# Altium schematic sheet 0271_GDDR6 VDD POL VREG.SchDoc
size 848 x 558 mm
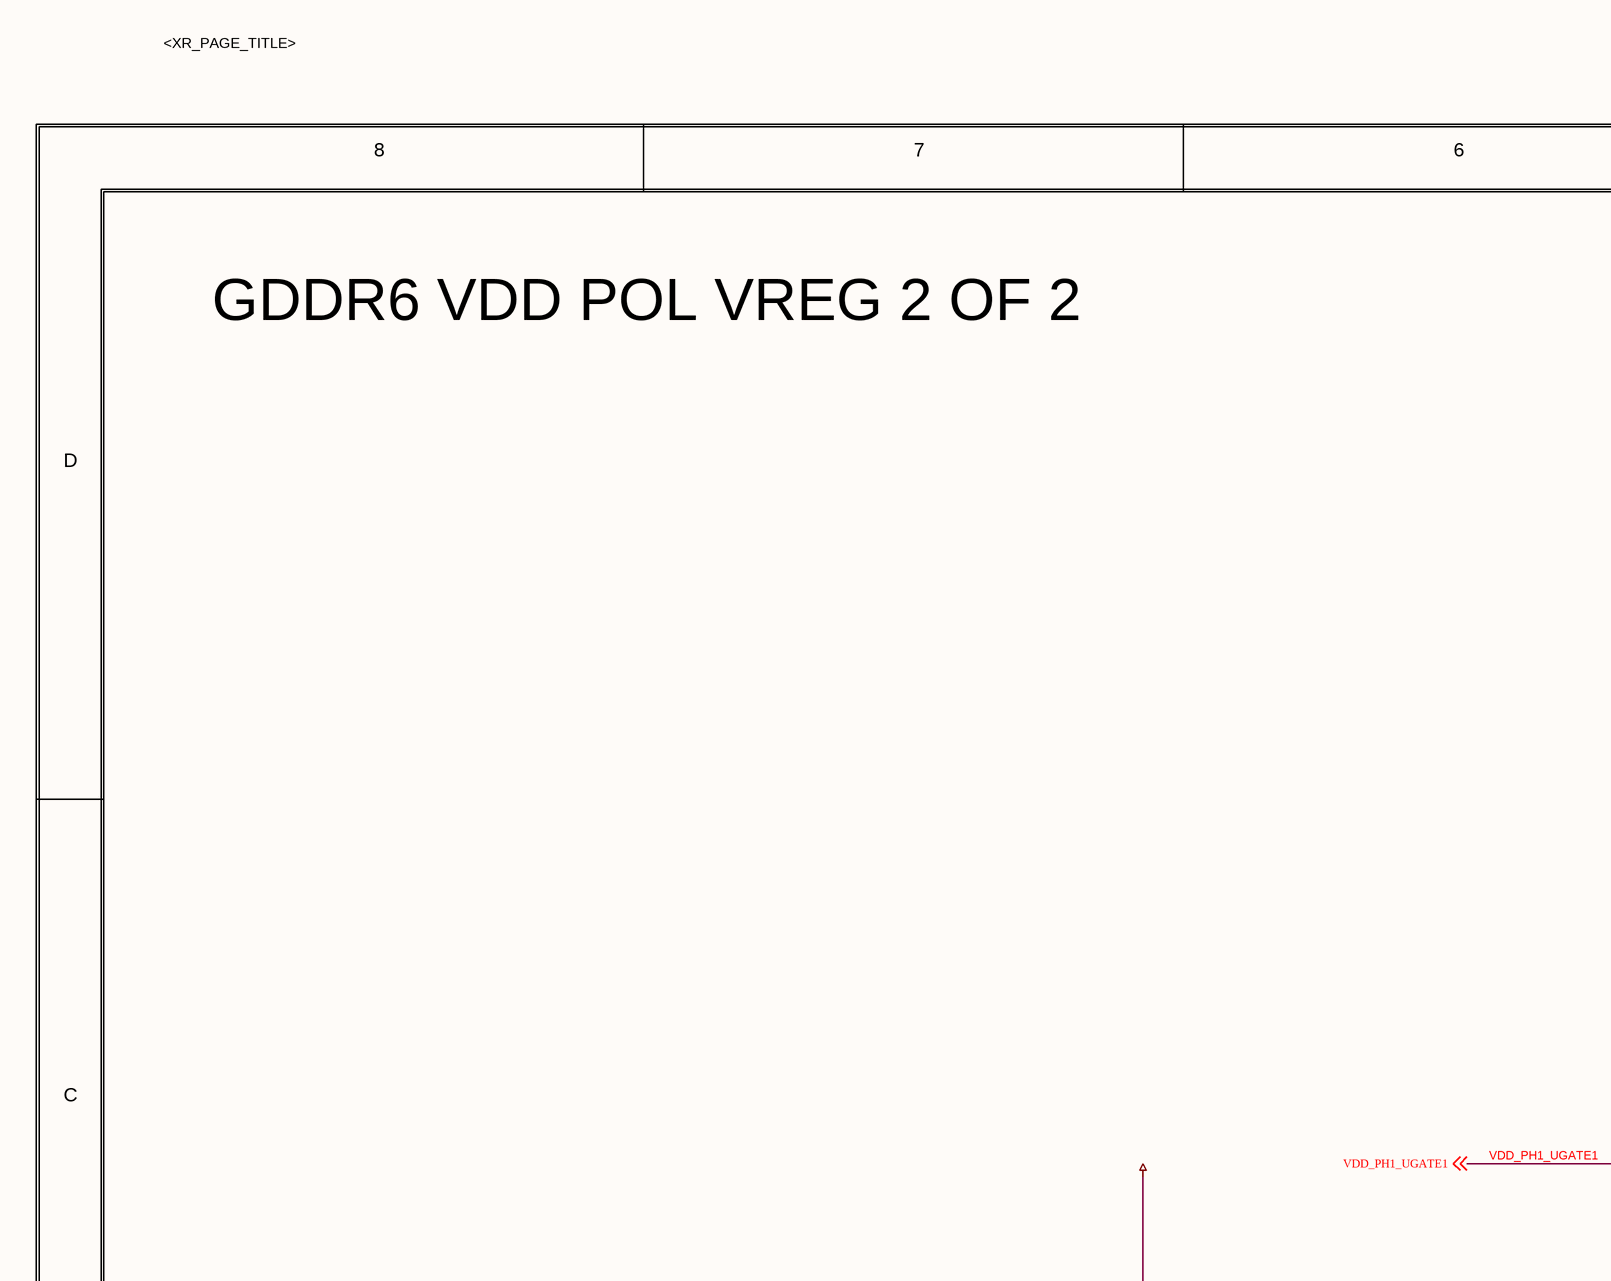
[diagram p0: 0271_GDDR6 VDD POL VREG.SchDoc, top left]
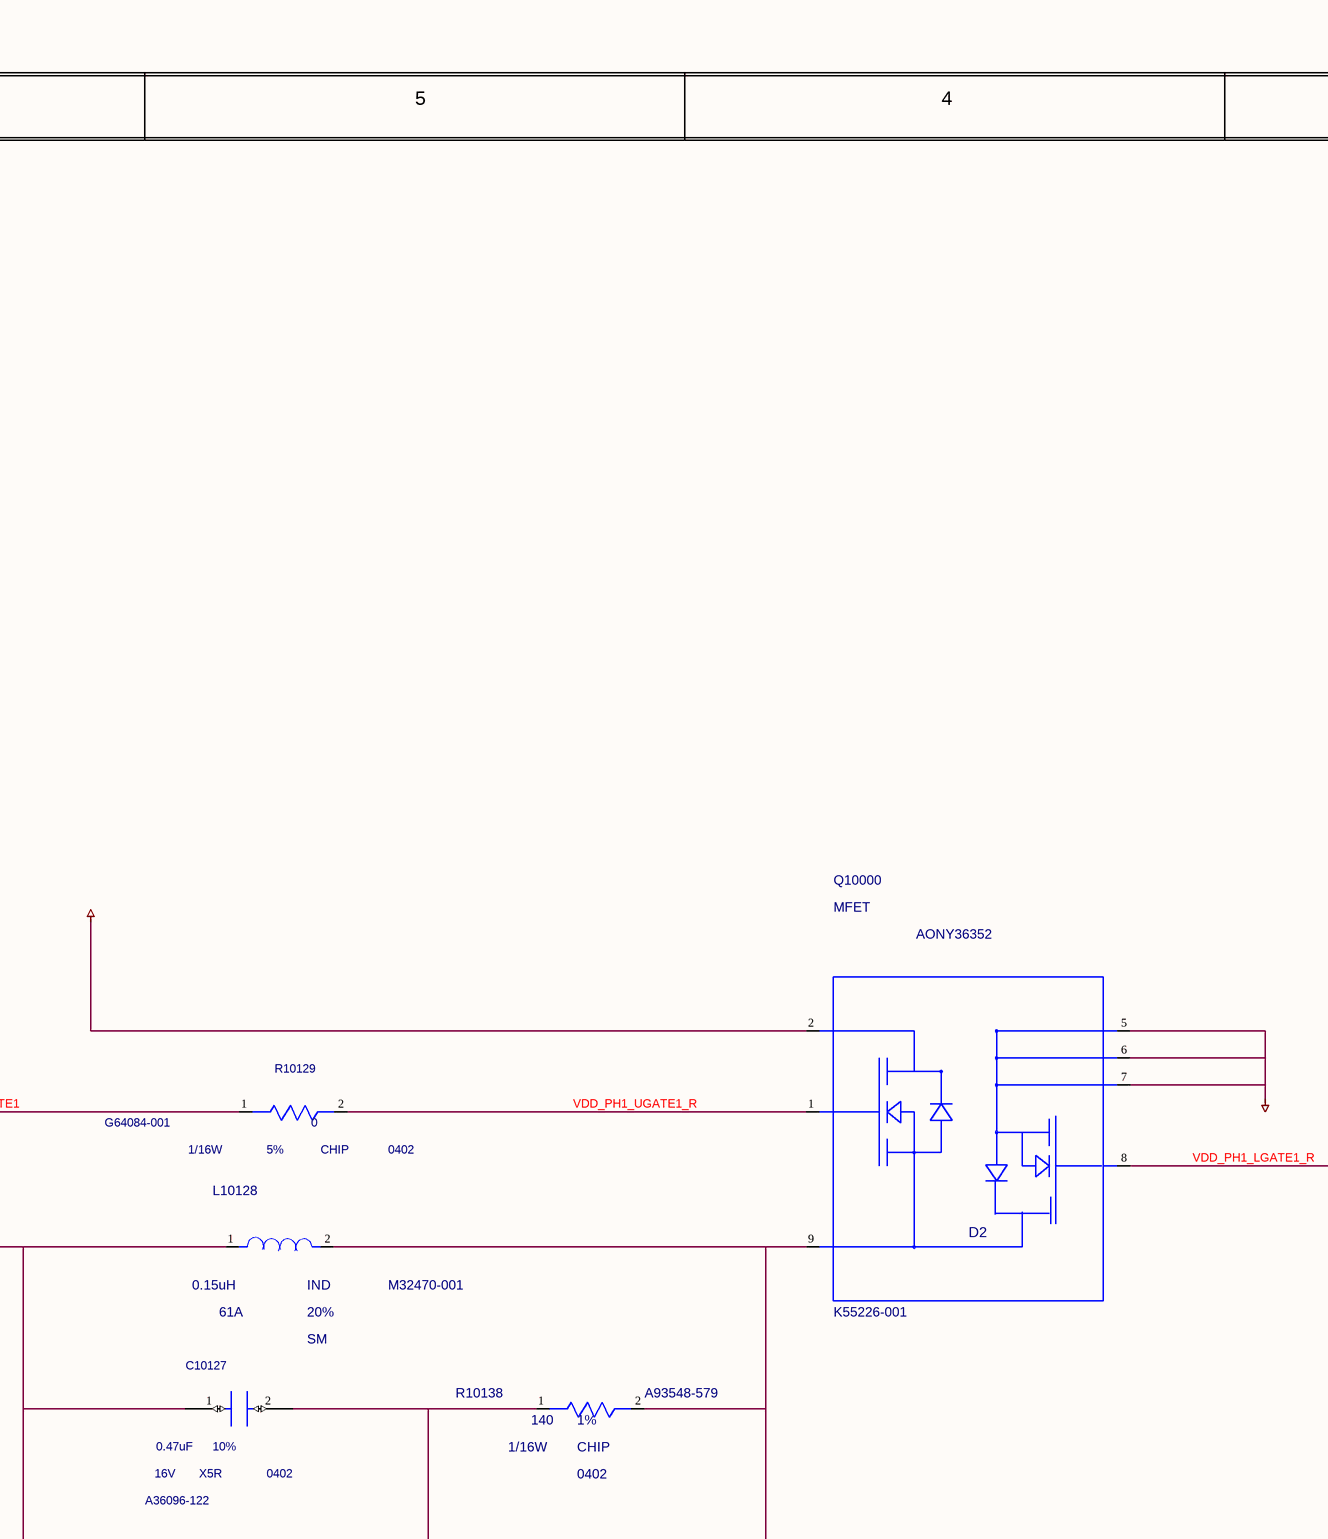
[diagram p1: 0271_GDDR6 VDD POL VREG.SchDoc, top middle]
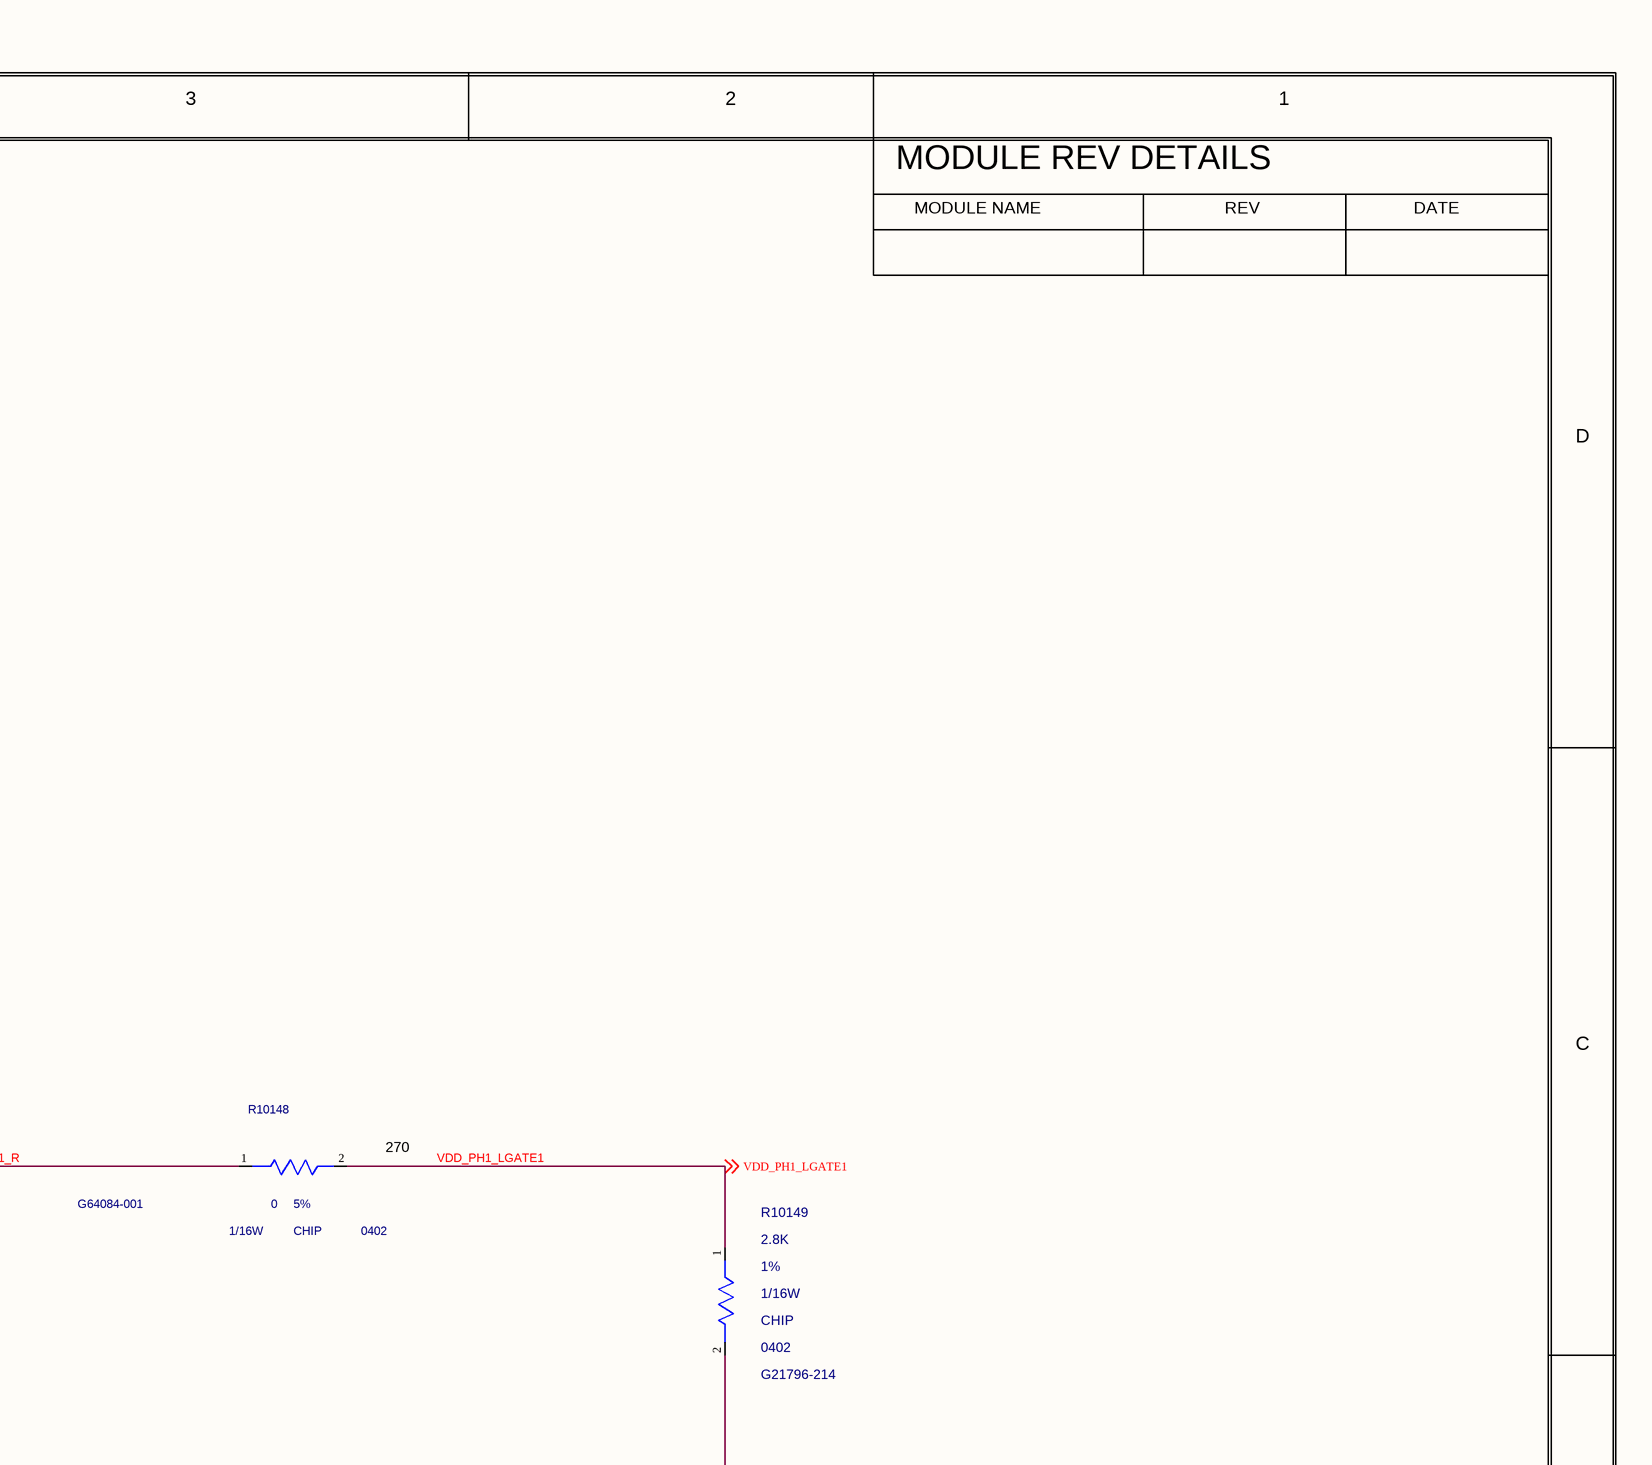
[diagram p2: 0271_GDDR6 VDD POL VREG.SchDoc, top right]
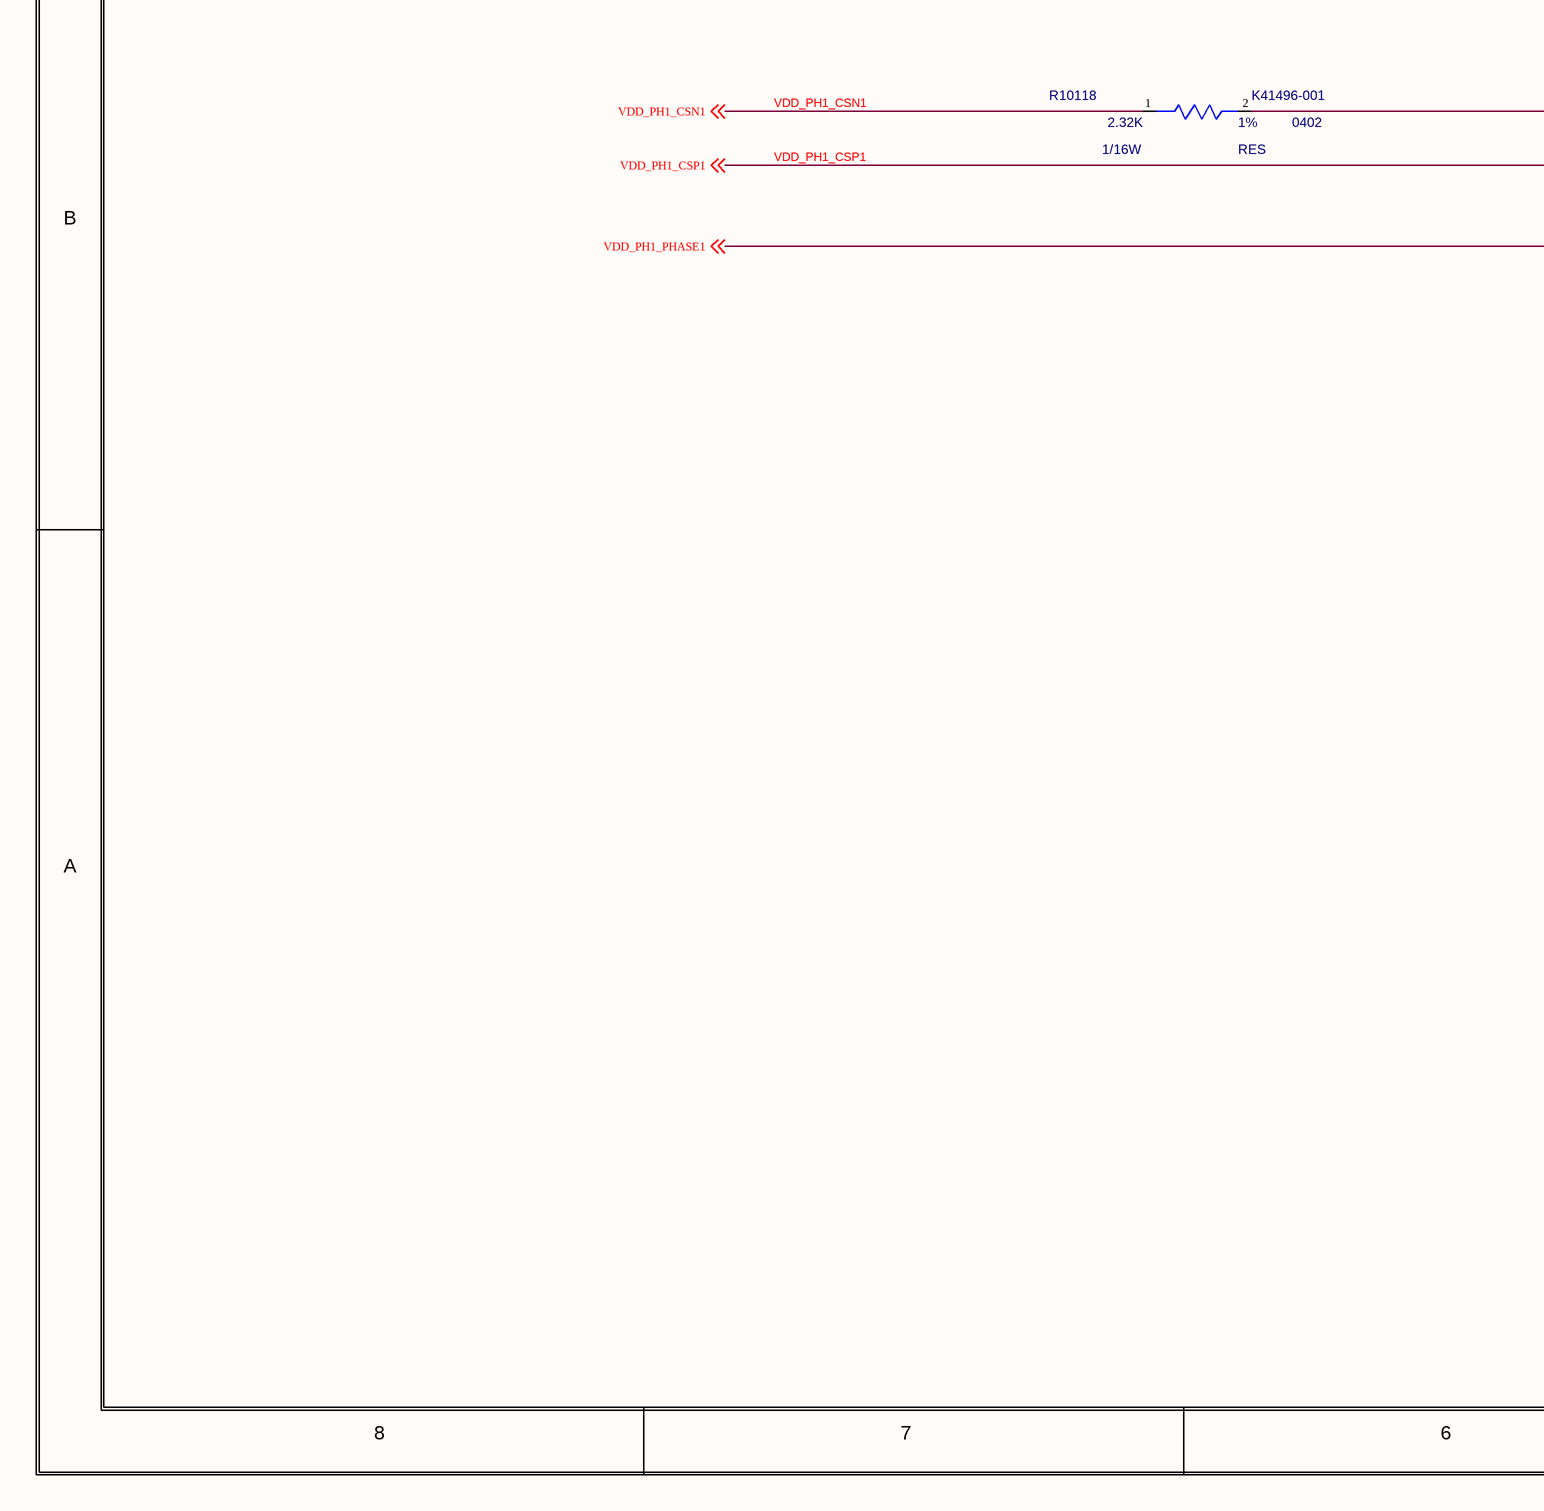
[diagram p3: 0271_GDDR6 VDD POL VREG.SchDoc, bottom left]
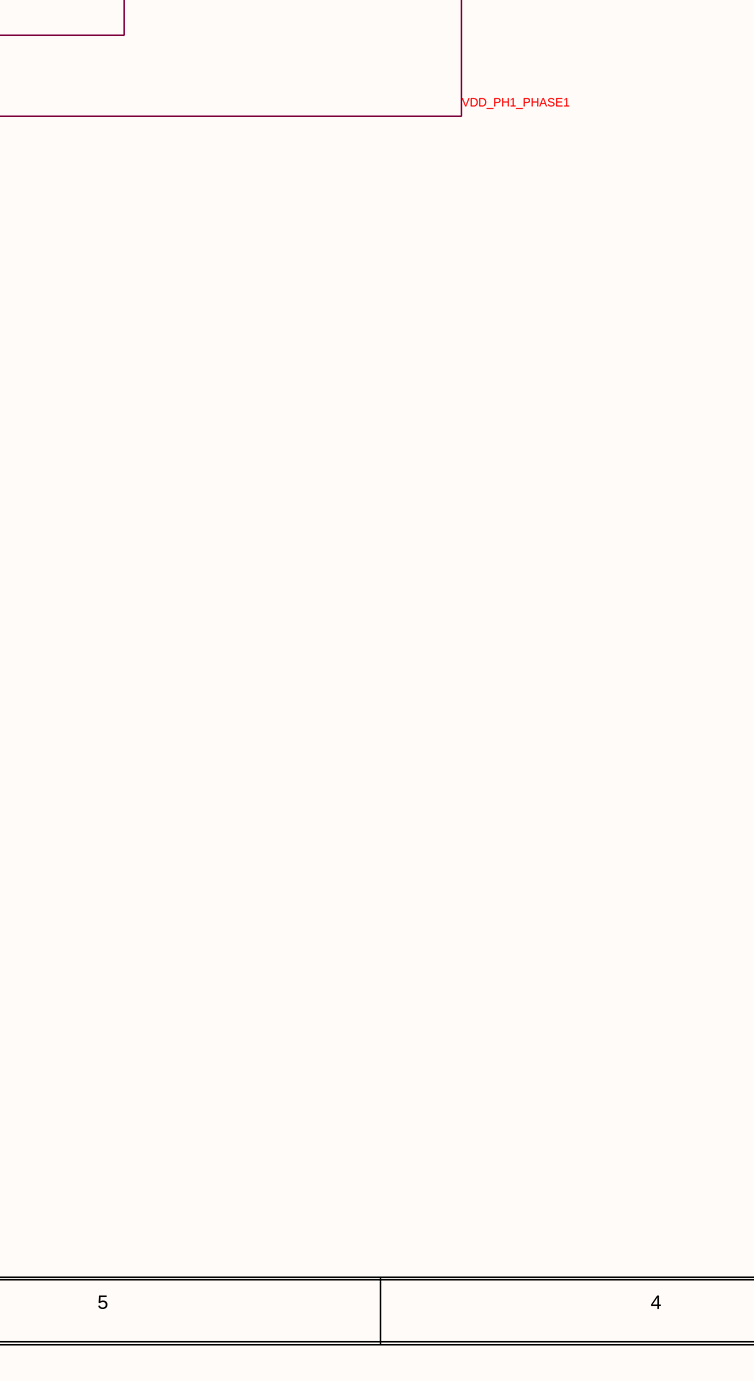
[diagram p4: 0271_GDDR6 VDD POL VREG.SchDoc, bottom middle]
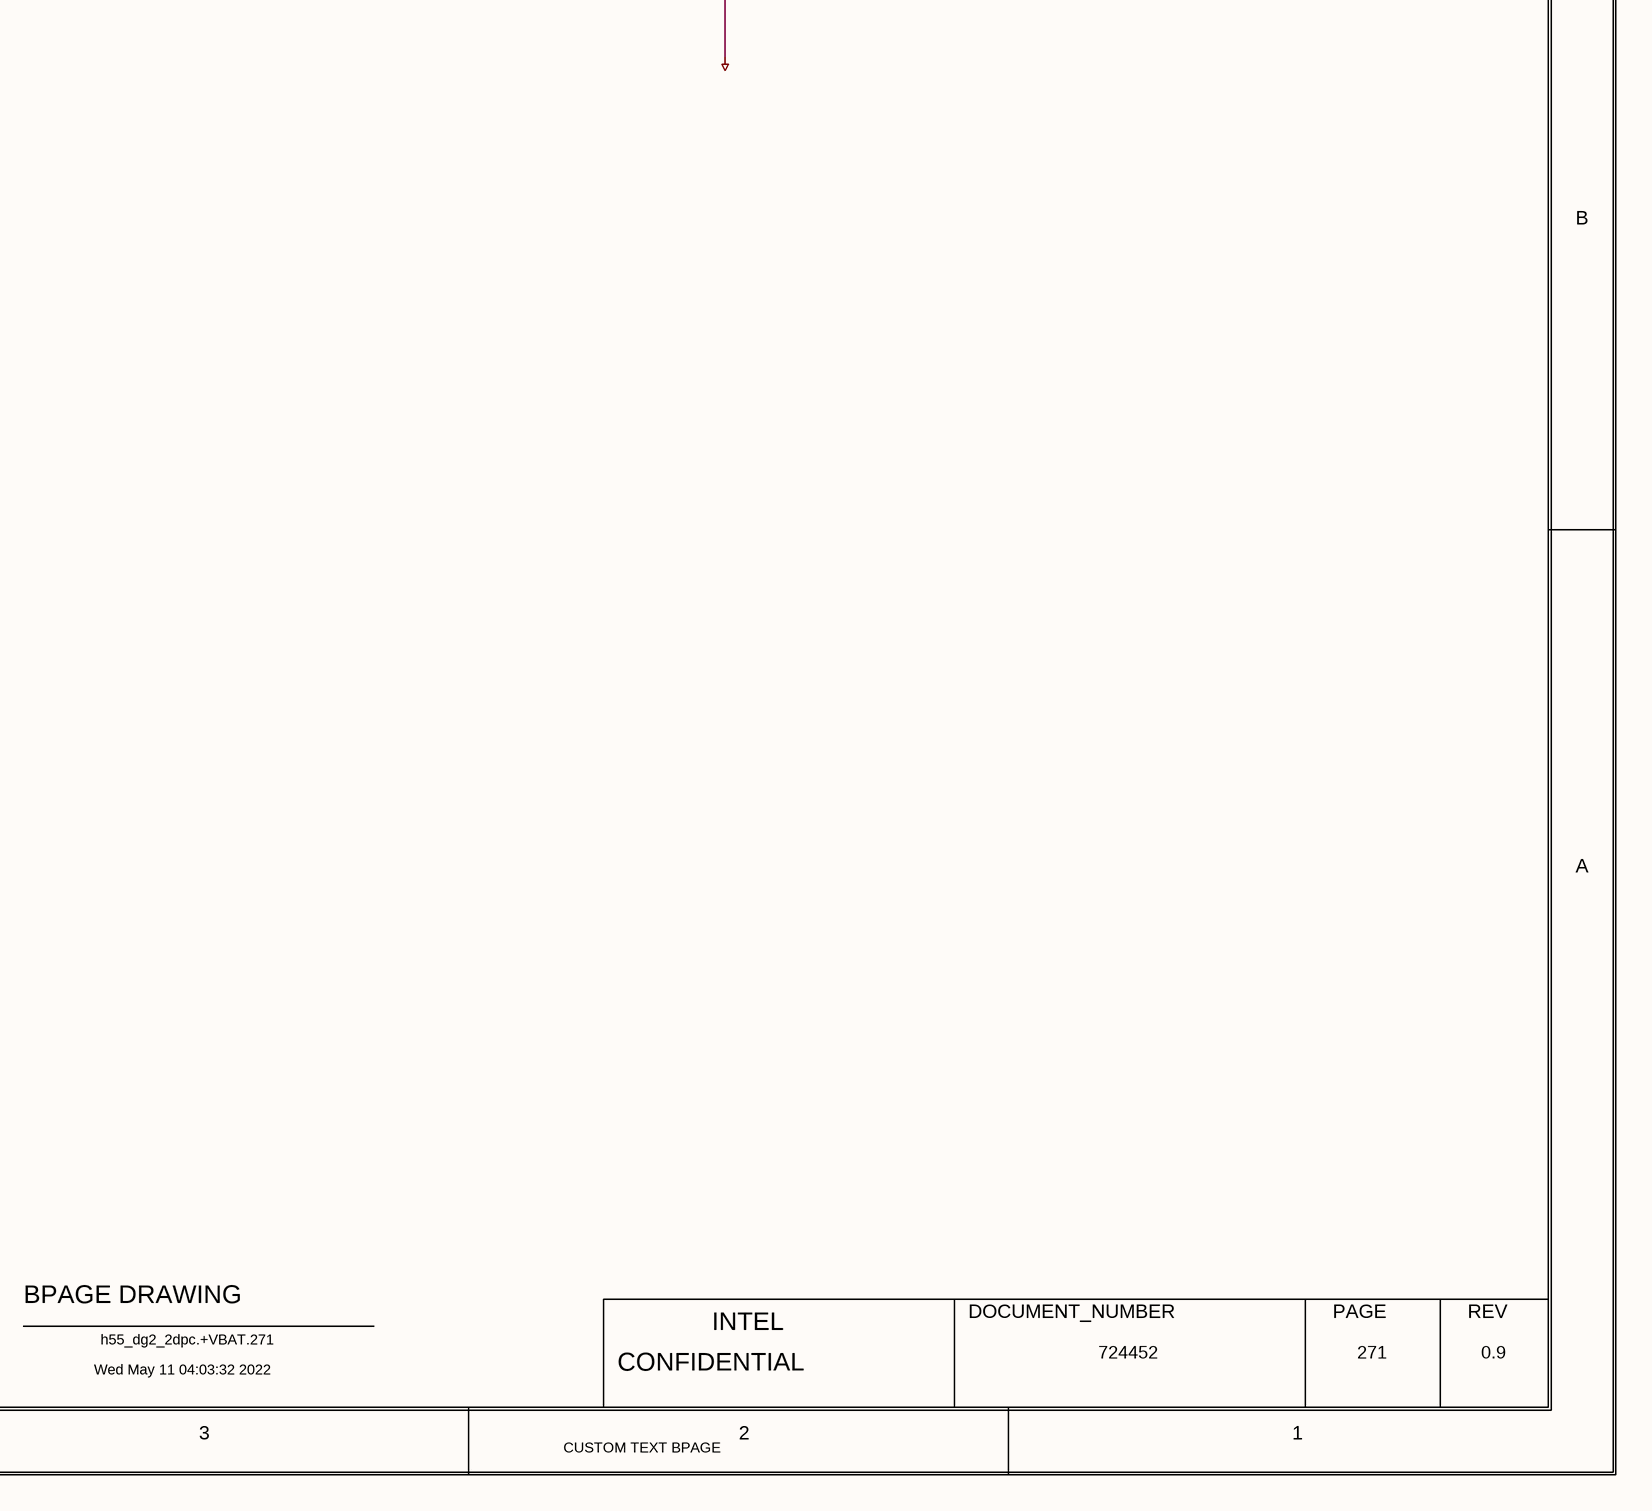
[diagram p5: 0271_GDDR6 VDD POL VREG.SchDoc, bottom right]

## Parts
C10127  0.47uF  MATERIAL: X5R  PACK_TYPE: 0402  PART_NUMBER: A36096-122  TOLERANCE: 10%  VOLTAGE: 16V  [SMC0402IA]
L10128  0.15uH  CURRENT: 61A  MATERIAL: IND  PACK_TYPE: SM  PART_NUMBER: M32470-001  TOLERANCE: 20%  [CTK2_SM_7300X6800_MA]
Q10000  AONY36352  MATERIAL: MFET  PART_NUMBER: K55226-001  [TK0_LCC8_5650X5300_1270_DF2550X4650_MA_VR]
R10118  2.32K  MATERIAL: RES  PACK_TYPE: 0402  PART_NUMBER: K41496-001  TOLERANCE: 1%  WATTAGE: 1/16W  [SMR0402MA]
R10129  0  MATERIAL: CHIP  PACK_TYPE: 0402  PART_NUMBER: G64084-001  TOLERANCE: 5%  WATTAGE: 1/16W  [SMR0402IA]
R10138  140  MATERIAL: CHIP  PACK_TYPE: 0402  PART_NUMBER: A93548-579  TOLERANCE: 1%  WATTAGE: 1/16W  [SMR0402IA]
R10148  0  MATERIAL: CHIP  PACK_TYPE: 0402  PART_NUMBER: G64084-001  TOLERANCE: 5%  WATTAGE: 1/16W  [SMR0402IA]
R10149  2.8K  MATERIAL: CHIP  PACK_TYPE: 0402  PART_NUMBER: G21796-214  TOLERANCE: 1%  WATTAGE: 1/16W  [SMR0402IA]

## Nets
+VBATA_VDD_GDDR6: Q10000.2(D1)
+VDD_GDDR6: C10127.1(A) L10128.1(INA) R10118.2(B)
GND: Q10000.5(S2_1) Q10000.6(S2_2) Q10000.7(S2_3) R10149.2(B)
VDD_PH1_CSN1: R10118.1(A) ; off-sheet VDD_PH1_CSN1
VDD_PH1_CSP1: C10127.2(B) R10138.1(A) ; off-sheet VDD_PH1_CSP1
VDD_PH1_LGATE1: R10148.2(B) R10149.1(A) ; off-sheet VDD_PH1_LGATE1
VDD_PH1_LGATE1_R: Q10000.8(G2) R10148.1(A)
VDD_PH1_PHASE1: L10128.2(INB) Q10000.9(S1_D2) R10138.2(B) ; off-sheet VDD_PH1_PHASE1
VDD_PH1_UGATE1: R10129.1(A) ; off-sheet VDD_PH1_UGATE1
VDD_PH1_UGATE1_R: Q10000.1(G1) R10129.2(B)

## Notes on the sheet
- <XR_PAGE_TITLE>
- 8
- 7
- 6
- 5
- 4
- 3
- 2
- 1
- MODULE REV DETAILS
- MODULE NAME
- REV
- DATE
- GDDR6 VDD POL VREG 2 OF 2
- D
- C
- (near R10148) 270
- B
- A
- BPAGE DRAWING
- INTEL
- DOCUMENT_NUMBER
- PAGE
- Wed May 11 04:03:32 2022
- h55_dg2_2dpc.+VBAT.271
- CONFIDENTIAL
- 724452
- 271
- 0.9
- CUSTOM TEXT BPAGE
- (in symbol MOSFET_N_DUAL_ASYM_2) D2

## Library data of the parts
C10127 = CAP#1: CHIPS_PART_NAME: CAP; CDS_PHYS_PART_NAME: CAP_0402-A36096-122,X5R,0.47UF,16V,10%,LPDB,GENERIC; OriginalSymbolOrigin: (-25,50); XY: (-4825,2650); VER: 2; ROT: 0; PHYS_PAGE: 271; LOCATION: C10127; DRAWING: @RVP1_ADL_SB_ADP_S_DDR5_SODIMM_2DPC_LIB.H55_DG2_2DPC(SCH_1):PAGE444; CDS_LIB: discrete; PCB Footprint: SMC0402IA; CDS_PART_NAME: CAP_0402-A36096-122,X5R,0.47UF,16V,10%,LPDB,GENERIC; CDS_LOCATION: C10127
L10128 = C_INDUCTOR: CDS_PHYS_PART_NAME: C_INDUCTOR_SM-M32470-001,IND,0.15UH,20%,61A,TK2,GENERIC; CDS_LMAN_SYM_OUTLINE: -100,50,100,-50; FP_TECH: TK2; IP: GENERIC; ROOM: NONE; OriginalSymbolOrigin: (-75,25); XY: (-4750,2950); VER: 1; ROT: 0; PHYS_PAGE: 271; LOCATION: L10128; DRAWING: @RVP1_ADL_SB_ADP_S_DDR5_SODIMM_2DPC_LIB.H55_DG2_2DPC(SCH_1):PAGE444; CDS_LIB: local; VARIANT: ?; PCB Footprint: CTK2_SM_7300X6800_MA; CHIPS_PART_NAME: C_INDUCTOR; CDS_PART_NAME: C_INDUCTOR_SM-M32470-001,IND,0.15UH,20%,61A,TK2,GENERIC; CDS_LOCATION: L10128
Q10000 = MOSFET_N_DUAL_ASYM_2: CDS_PHYS_PART_NAME: MOSFET_N_DUAL_ASYM_2_LCC-K55226-001,MFET,AONY36352,TK0,GENERIC; CDS_LMAN_SYM_OUTLINE: -250,300,250,-300; FP_TECH: TK0; IP: GENERIC; PACK_TYPE: LCC; ROOM: NONE; OriginalSymbolOrigin: (-275,300); XY: (-3475,3150); VER: 1; ROT: 0; PHYS_PAGE: 271; LOCATION: Q10000; DRAWING: @RVP1_ADL_SB_ADP_S_DDR5_SODIMM_2DPC_LIB.H55_DG2_2DPC(SCH_1):PAGE444; CDS_LIB: local; VARIANT: ?; PCB Footprint: TK0_LCC8_5650X5300_1270_DF2550X4650_MA_VR; SEC_TYPE: LCC; CHIPS_PART_NAME: MOSFET_N_DUAL_ASYM_2; CDS_PART_NAME: MOSFET_N_DUAL_ASYM_2_LCC-K55226-001,MFET,AONY36352,TK0,GENERIC; CDS_LOCATION: Q10000
R10118 = RES#1: CDS_PHYS_PART_NAME: RES_0402-K41496-001,RES,2.32K,1%,1/16W,LPDB,GENERIC; OriginalSymbolOrigin: (-75,25); XY: (-5975,2400); VER: 1; ROT: 0; PHYS_PAGE: 271; LOCATION: R10118; IP: GENERIC; FP_TECH: LPDB; DRAWING: @RVP1_ADL_SB_ADP_S_DDR5_SODIMM_2DPC_LIB.H55_DG2_2DPC(SCH_1):PAGE444; CDS_LIB: discrete; PCB Footprint: SMR0402MA; CHIPS_PART_NAME: RES; CDS_PART_NAME: RES_0402-K41496-001,RES,2.32K,1%,1/16W,LPDB,GENERIC; CDS_LOCATION: R10118
R10129 = RES#1: CHIPS_PART_NAME: RES; CDS_PHYS_PART_NAME: RES_0402-G64084-001,CHIP,0,5%,1/16W,LPDB,GENERIC; OriginalSymbolOrigin: (-75,25); XY: (-4725,3200); VER: 1; PHYS_PAGE: 271; LOCATION: R10129; IP: GENERIC; FP_TECH: LPDB; DRAWING: @RVP1_ADL_SB_ADP_S_DDR5_SODIMM_2DPC_LIB.H55_DG2_2DPC(SCH_1):PAGE444; CDS_LIB: discrete; PCB Footprint: SMR0402IA; ROT: 0; CDS_PART_NAME: RES_0402-G64084-001,CHIP,0,5%,1/16W,LPDB,GENERIC; CDS_LOCATION: R10129
R10138 = RES#1: CHIPS_PART_NAME: RES; CDS_PHYS_PART_NAME: RES_0402-A93548-579,CHIP,140,1%,1/16W,LPDB,GENERIC; OriginalSymbolOrigin: (-75,25); XY: (-4175,2650); VER: 1; ROT: 0; PHYS_PAGE: 271; LOCATION: R10138; IP: GENERIC; FP_TECH: LPDB; DRAWING: @RVP1_ADL_SB_ADP_S_DDR5_SODIMM_2DPC_LIB.H55_DG2_2DPC(SCH_1):PAGE444; CDS_LIB: discrete; PCB Footprint: SMR0402IA; CDS_PART_NAME: RES_0402-A93548-579,CHIP,140,1%,1/16W,LPDB,GENERIC; CDS_LOCATION: R10138
R10148 = RES#1: CHIPS_PART_NAME: RES; CDS_PHYS_PART_NAME: RES_0402-G64084-001,CHIP,0,5%,1/16W,LPDB,GENERIC; OriginalSymbolOrigin: (-75,25); XY: (-2325,3100); VER: 1; PHYS_PAGE: 271; LOCATION: R10148; IP: GENERIC; FP_TECH: LPDB; DRAWING: @RVP1_ADL_SB_ADP_S_DDR5_SODIMM_2DPC_LIB.H55_DG2_2DPC(SCH_1):PAGE444; CDS_LIB: discrete; PCB Footprint: SMR0402IA; ROT: 0; CDS_PART_NAME: RES_0402-G64084-001,CHIP,0,5%,1/16W,LPDB,GENERIC; CDS_LOCATION: R10148
R10149 = RES: CDS_PHYS_PART_NAME: RES_0402-G21796-214,CHIP,2.8K,1%,1/16W,LPDB,GENERIC; OriginalSymbolOrigin: (-25,75); XY: (-1525,2850); VER: 2; ROT: 0; PHYS_PAGE: 271; LOCATION: R10149; IP: GENERIC; FP_TECH: LPDB; DRAWING: @RVP1_ADL_SB_ADP_S_DDR5_SODIMM_2DPC_LIB.H55_DG2_2DPC(SCH_1):PAGE444; CDS_LIB: discrete; PCB Footprint: SMR0402IA; CHIPS_PART_NAME: RES; CDS_PART_NAME: RES_0402-G21796-214,CHIP,2.8K,1%,1/16W,LPDB,GENERIC; CDS_LOCATION: R10149